# EAGLE design openSX70-dongle_v3-2 (EAGLE 8.6.3)
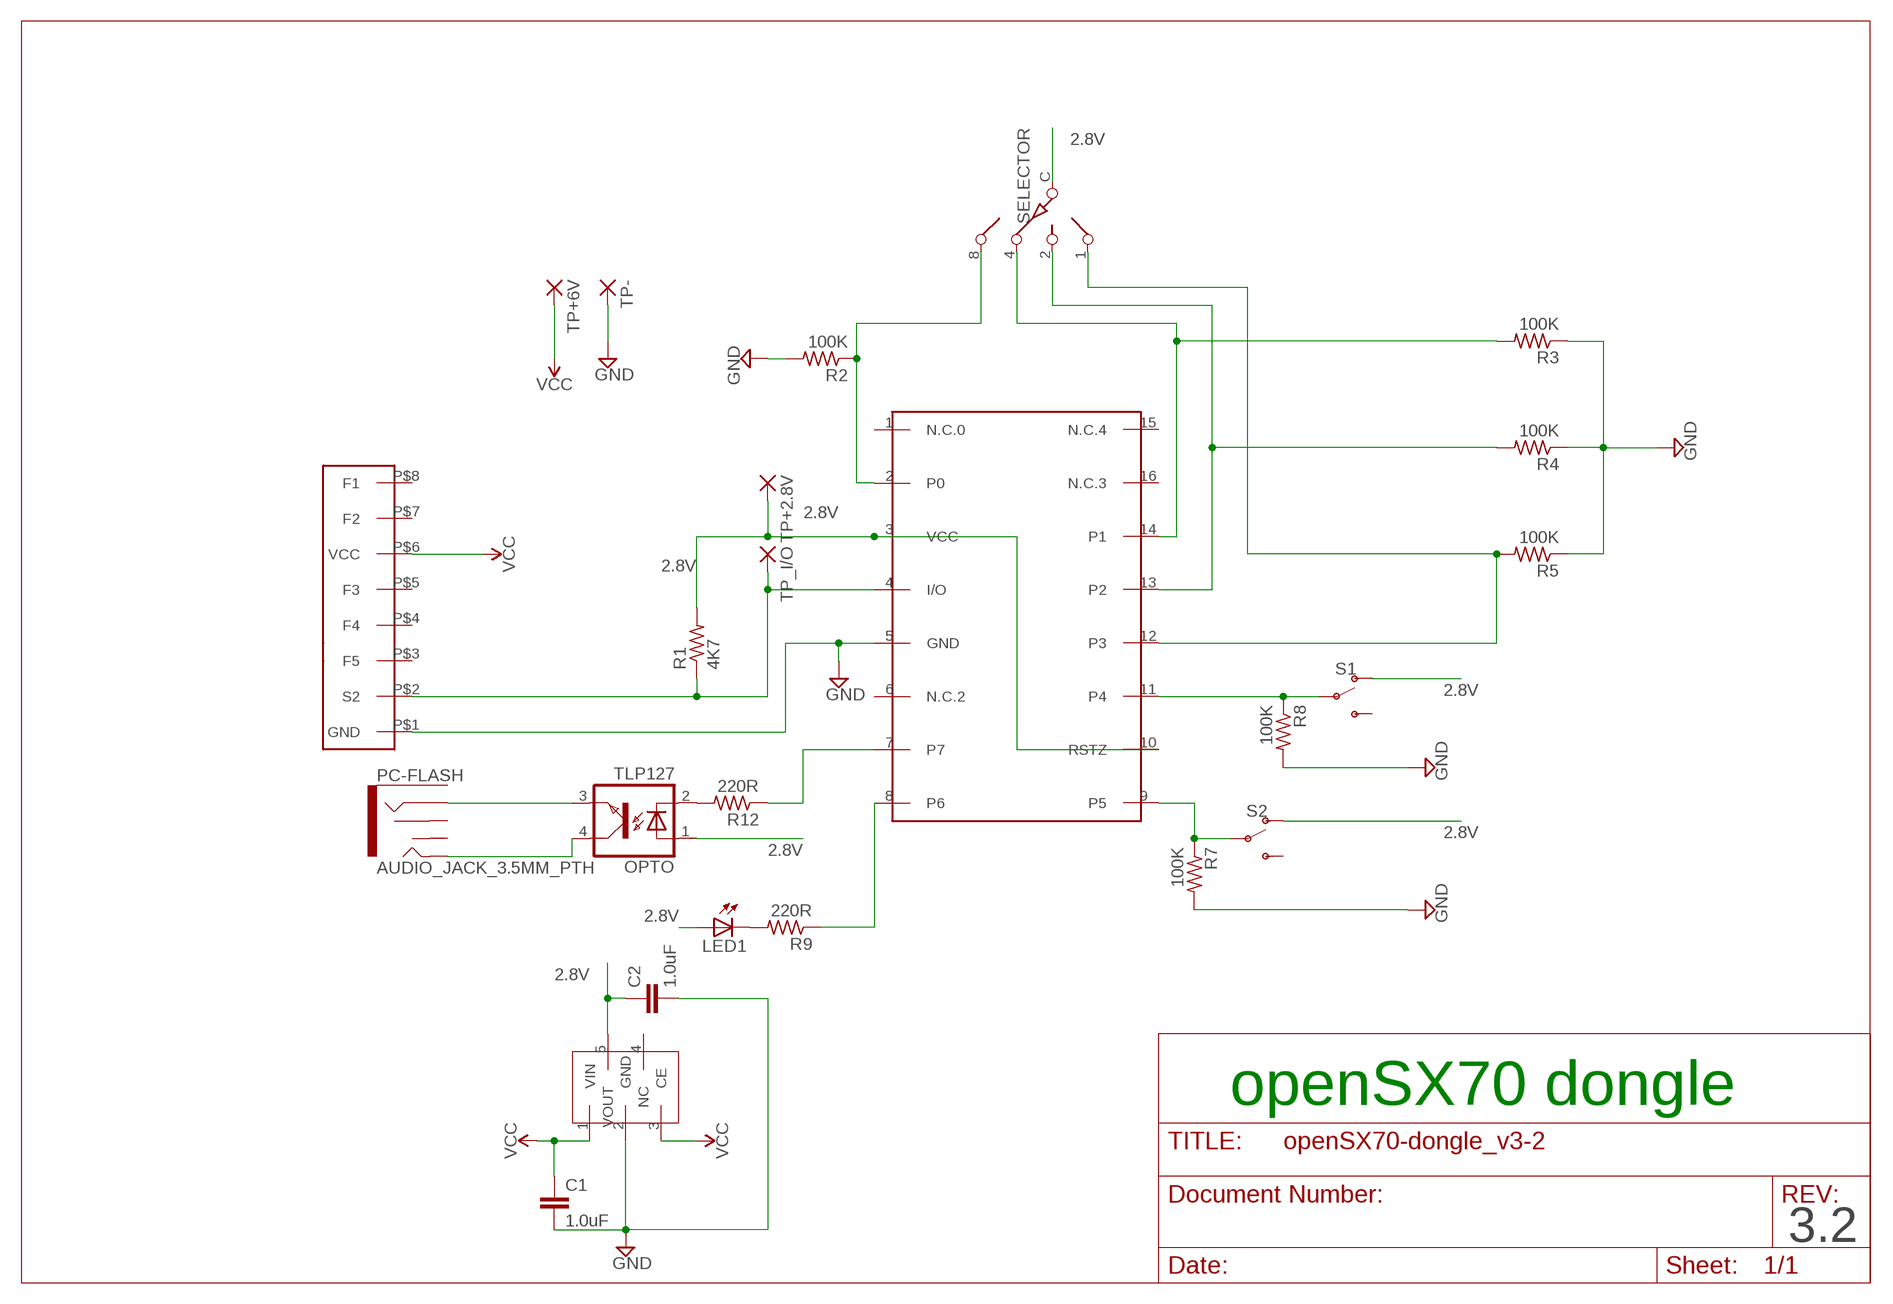
[diagram p0: schematic, sheet 1]

## Parts
C1  1.0uF  C-EUC0603  [C0603]
C2  1.0uF  C-EUC0603  [C0603]
DS2408  DS2408  [SO16]
LED1  LED3MM  [LED3MM]
OPTO  TLP127  [SO-4]
PC-FLASH  AUDIO_JACK_3.5MM_PTH  [AUDIO-JACK]
R1  4K7  R-US_M0805  [M0805]
R2  100K  R-US_M0805  [M0805]
R3  100K  R-US_M0805  [M0805]
R4  100K  R-US_M0805  [M0805]
R5  100K  R-US_M0805  [M0805]
R7  100K  R-US_M0805  [M0805]
R8  100K  R-US_M0805  [M0805]
R9  220R  R-US_M0805  [M0805]
R12  220R  R-US_M0805  [M0805]
REG  NCP4688  [SOT-23-5]
S1  SWITCH-SPDT-SMD-RIGHT-ANGLE  [SWITCH_SPST_SMD_A]
S2  SWITCH-SPDT-SMD-RIGHT-ANGLE  [SWITCH_SPST_SMD_A]
SELECTOR  SW-C16  [SW-C16]
TP+2.8V  SMD2  [SMD1,27-2,54]
TP+6V  SMD2  [SMD1,27-2,54]
TP-  SMD2  [SMD1,27-2,54]
TP_I/O  SMD2  [SMD1,27-2,54]
U$1  FLASH-EDGE-CONNECTOR  [FLASH-EDGE-8]

## Nets
2.8V: C2.1 DS2408.3(VCC) DS2408.10(RSTZ) LED1.A OPTO.1(A) R1.2 REG.5(VOUT) S1.1(O) S2.1(O) SELECTOR.C TP+2.8V.1(P)
GND: C1.2 C2.2 DS2408.5(GND) R2.2 R3.1 R4.1 R5.1 R7.2 R8.2 REG.2(GND) TP-.1(P) U$1.P$1(GND)
N$1: DS2408.4(I/O) R1.1 TP_I/O.1(P) U$1.P$2(S2)
N$2: LED1.K(C) R9.2
N$3: DS2408.2(P0) R2.1 SELECTOR.8
N$4: DS2408.14(P1) R3.2 SELECTOR.4
N$5: DS2408.13(P2) R4.2 SELECTOR.2
N$6: DS2408.11(P4) R8.1 S1.2(P)
N$7: DS2408.9(P5) R7.1 S2.2(P)
N$8: DS2408.8(P6) R9.1
N$10: OPTO.2(C) R12.2
N$11: DS2408.7 R12.1
N$12: OPTO.4(COL) PC-FLASH.TIP
N$13: DS2408.12(P3) R5.2 SELECTOR.1
N$15: OPTO.3(EMIT) PC-FLASH.RING
VCC: C1.1 REG.1(VIN) REG.3(CE) TP+6V.1(P) U$1.P$6(VCC)
Unconnected: DS2408.1(N.C.0) DS2408.6(N.C.2) DS2408.15(N.C.4) DS2408.16(N.C.3) PC-FLASH.RSH PC-FLASH.SLEEVE PC-FLASH.TSH REG.4(NC) S1.3(S) S2.3(S) U$1.P$3(F5) U$1.P$4(F4) U$1.P$5(F3) U$1.P$7(F2) U$1.P$8(F1)

## Notes on the sheet
- openSX70 dongle
- 3.2

## Library data of the parts
C1 C2 = rcl:C-EU: CAPACITOR, European symbol; SPICEPREFIX: C
DS2408 = DS2408-joaco:DS2408
LED1 = adafruit:LED: LED OSRAM: - CHIPLED LG R971, LG N971, LY N971, LG Q971, LY Q971, LO R971, LY R971 LH N974, LH R974 LS Q976, LO Q976, LY Q976 LO Q996 - Hyper CHIPLED LW Q18S LB Q993, LB Q99A, LB R99A - SideLED LS A670, LO A670, LY A670, LG A670, LP A670 LB A673, LV A673, LT A673, LW A673 LH A674 LY A675 LS A676, LA A676, LO A676, LY A676, LW A676 LS A679, LY A679, LG A679 - Hyper Micro SIDELED® LS Y876, LA Y876, LO Y876, LY Y876 LT Y87S - SmartLED LW L88C, LW L88S LB L89C, LB L89S, LG L890 LS L89K, LO L89K, LY L89K LS L896, LA L896, LO L896, LY L896 - TOPLED LS T670, LO T670, LY T670, LG T670, LP T670 LSG T670, LSP T670, LSY T670, LOP T670, LYG T670 LG T671, LOG T671, LSG T671 LB T673, LV T673, LT T673, LW T673 LH T674 LS T676, LA T676, LO T676, LY T676, LB T676, LH T676, LSB T676, LW T676 LB T67C, LV T67C, LT T67C, LS T67K, LO T67K, LY T67K, LW E67C LS E67B, LA E67B, LO E67B, LY E67B, LB E67C, LV E67C, LT E67C LW T67C LS T679, LY T679, LG T679 LS T770, LO T770, LY T770, LG T770, LP T770 LB T773, LV T773, LT T773, LW T773 LH T774 LS E675, LA E675, LY E675, LS T675 LS T776, LA T776, LO T776, LY T776, LB T776 LHGB T686 LT T68C, LB T68C - Hyper Mini TOPLED® LB M676 - Mini TOPLED Santana® LG M470 LS M47K, LO M47K, LY M47K Source: http://www.osram.convergy.de/
OPTO = openSX70:TLP127
PC-FLASH = SparkFun-Connectors:AUDIO_JACK_3.5MM: Audio Jack 3.5mm variants of PTH and SMT stereo audio jack with bypass switches. SparkFun Products: SparkFun SparkPunk Sound Kit <[https://www.sparkfun.com/products/11177]> - PTH MP3 Trigger <https://www.sparkfun.com/products/13720> -3.5mm SMD SparkFun PicoBoard <https://www.sparkfun.com/products/11888>- 2.5mm SMD; PROD_ID: CONN-08774; SF_ID: PRT-08032
R1-R5 R7-R9 R12 = rcl:R-US_: RESISTOR, American symbol; SPICEPREFIX: R
REG = openSX70:NCP4688
S1 S2 = SparkFun-Switches:SWITCH-SPDT: Single Pole, Double Throw (SPDT) Switch Single-pole, double-throw (SPDT) switch. Variant Overview SMD-AYZ0202 Surface Mount DPDT Switch <https://www.sparkfun.com/products/597> (COM-00597) Used on e.g. LilyPad Arduino USB - ATmega32U4 Board <https://www.sparkfun.com/products/12049> PTH-11.6X4.0MM SPDT Mini Power Switch <https://www.sparkfun.com/products/102> (COM-00102) Used on e.g. SparkFun Simon Says - Through-Hole Soldering Kit <https://www.sparkfun.com/products/10547> (KIT-10547) PTH-11.6X4.0MM-KIT KIT version of SPDT Mini Power Switch - Simplifies soldering by removing tStop of switch pins - only one side can be soldered. PTH-11.6X4.0MM-LOCK LOCK version of SPDT Mini Power Switch - Offset pins hold switch in place for easier soldering. SMD-RIGHT-ANGLE Surface Mount Right Angle Switch <https://www.sparkfun.com/products/10860> (COM-10860) Used on e.g. SparkFun ESP8266 Thing <https://www.sparkfun.com/products/13231>; PROD_ID: SWCH-10651; SF_SKU: COM-10860
SELECTOR = special:SW-C16: SWITCH 16-step rotary switch
TP+2.8V TP+6V TP- TP_I/O = wirepad:SMD2: SMD PAD
U$1 = SX70-flash:FLASH-EDGE-CONNECTOR

## Net classes
0 GND: width 0.305 mm
1 VCC: width 0.254 mm
2 2.8V: width 0.254 mm

## Board
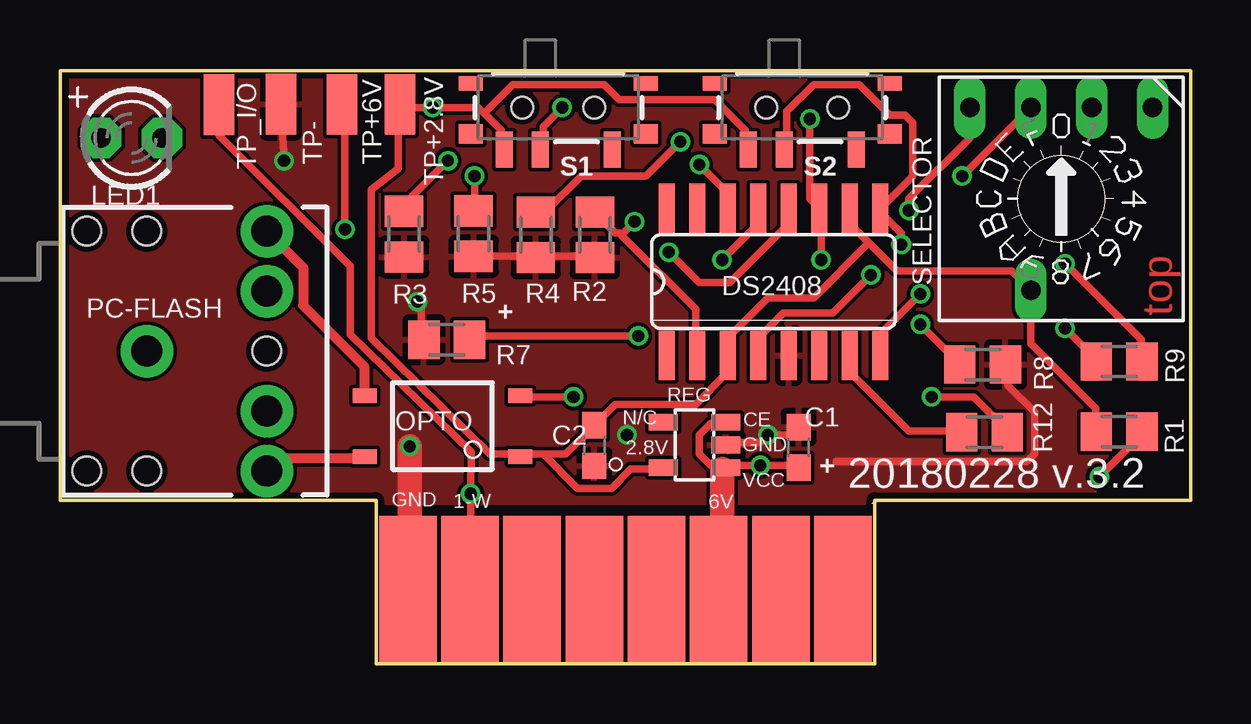
[diagram p1: board, top side]
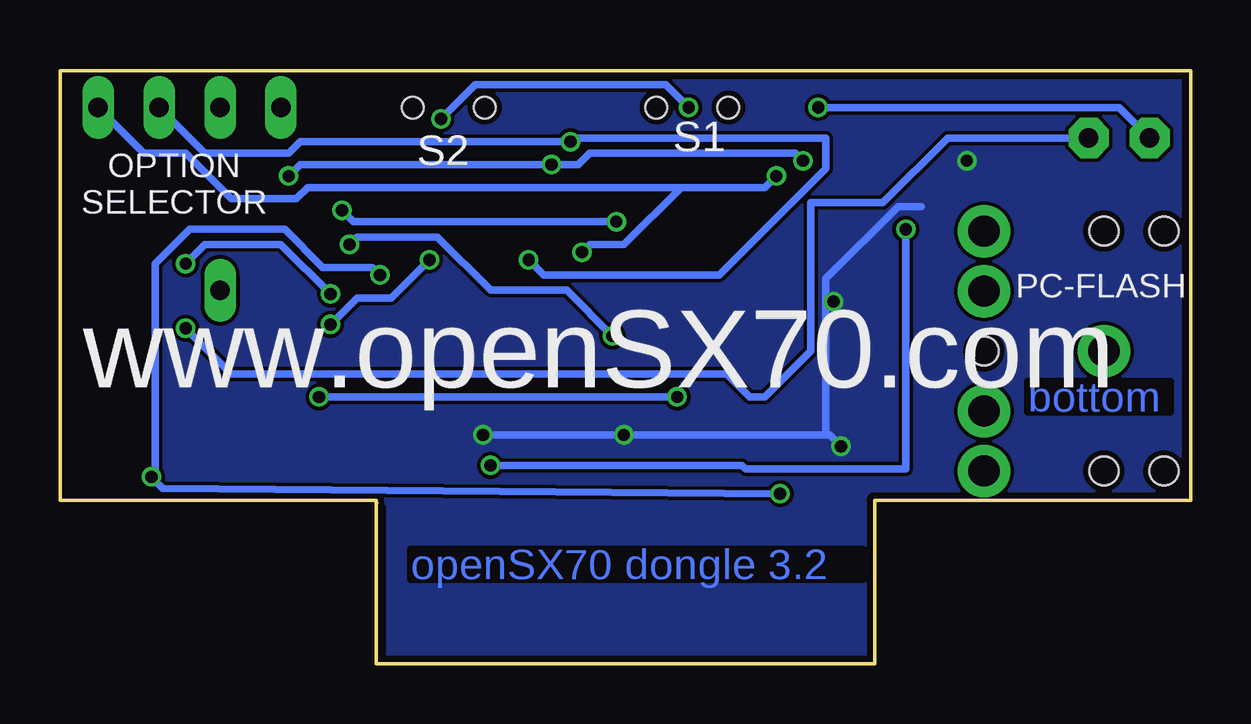
[diagram p2: board, bottom side, seen from below]

Size 47.12 x 24.71 mm. Coordinates in mm from the lower left corner, seen from the top.
Outline: 33.84,6.68 33.95,6.81
Outline: 33.95,6.81 33.95,0 13.17,0 13.17,6.81 0,6.81 0,24.71 47.12,24.71 47.12,6.81 33.95,6.81
Copper layers (1*16): Top 0.035mm / dielectric 1.5mm / Bottom 0.035mm
Design rules "SeeedStudio_2layer_DRU_no_angle_20140221": minimum track width 6mil, minimum drill 12mil, track to track 6mil, track to pad 6mil, pad to pad 6mil, via to via 6mil, smd to smd 0mil, copper to edge 10mil, drill to drill 10mil, minimum pad ring 10mil, minimum via ring 6mil, stop-mask expansion 2mil, vias tented up to drill 100mil, thermal gap 10mil

### Footprints (pad centres in the part's own frame; a part is rotated, then mirrored left to right if it is on the bottom)
C0603 = smd 1.1 x 1: 1 -0.85,0; 2 0.85,0
SO16 = smd 0.66 x 2.032: 1 -4.445,-3.073; 2 -3.175,-3.073; 3 -1.905,-3.073; 4 -0.635,-3.073; 5 0.635,-3.073; 6 1.905,-3.073; 7 3.175,-3.073; 8 4.445,-3.073; 9 4.445,3.073; 10 3.175,3.073; 11 1.905,3.073; 12 0.635,3.073; 13 -0.635,3.073; 14 -1.905,3.073; 15 -3.175,3.073; 16 -4.445,3.073
LED3MM = drill 0.813 pad 1.676 octagon: A -1.27,0; K 1.27,0
SO-4 = smd 1 x 0.6: 1 -3.24,0.635; 2 -3.24,-1.905; 3 3.24,-1.905; 4 3.24,0.635
AUDIO-JACK = drill 1.3 pad 2.184: RING 5,5; RSH 5,2.5; SLEEVE 0,0; TIP 5,-5; TSH 5,-2.5 | hole 1.2: 0,5; -2.5,5; -2.5,-5; 0,-5; 5,0
M0805 = smd 1.3 x 1.6: 1 -0.95,0; 2 0.95,0
SOT-23-5 = smd 0.69 x 1.2: 1 -0.95,-1.3; 2 0,-1.3; 3 0.95,-1.3; 4 0.95,1.3; 5 -0.95,1.3
SWITCH_SPST_SMD_A = smd 0.7 x 1.5: 1 -2.25,-1.75; 2 -0.75,-1.75; 3 2.25,-1.75 | smd 1 x 0.6: GND1 -3.65,1; GND3 3.65,1 | smd 1 x 0.8: GND2 -3.65,-1.1; GND4 3.65,-1.1 | hole 0.9: -1.5,0; 1.5,0
SW-C16 = drill 0.813 long: 1 -3.81,-3.81; 2 -1.27,-3.81; 4 1.27,-3.81; 8 3.81,-3.81; C 1.27,3.81
SMD1,27-2,54 = smd 1.27 x 2.54: 1 0,0
FLASH-EDGE-8 = smd 2.4 x 6.09: P$1 -9.065,0; P$2 -6.475,0; P$3 -3.885,0; P$4 -1.295,0; P$5 1.295,0; P$6 3.885,0; P$7 6.475,0; P$8 9.065,0

### Placement (x,y rotation side)
C1  30.77,9.02 90 top
C2  22.26,9.09 270 top
DS2408  29.73,15.93 0 top
LED1  2.98,21.92 0 top
OPTO  15.93,9.27 180 top
PC-FLASH  3.62,13.03 0 top
R1  44.13,9.68 180 top
R2  22.29,17.88 270 top
R3  14.34,17.91 90 top
R4  19.82,17.88 90 top
R5  17.23,17.93 90 top
R7  16.12,13.51 180 top
R8  38.44,12.47 0 top
R9  44.13,12.6 180 top
R12  38.52,9.65 0 top
REG  26.44,9.12 90 top
S1  20.76,23.19 0 top
S2  30.92,23.19 0 top
SELECTOR  41.72,19.38 180 top
TP+2.8V  14.16,23.32 0 top
TP+6V  11.75,23.32 0 top
TP-  9.21,23.33 0 top
TP_I/O  6.63,23.3 0 top
U$1  23.56,3.12 0 top

### Tracks (layer width: path | path; a pad name or v marks a point on that pad's centre or on a via)
2.8V  (via drill 0.51)
  Top 0.305: 17.67,22.95 17.43,23.19 v15.53,23.19 14.26,23.19 TP+2.8V.1 14.1,23.19 14.1,20.65 12.97,19.77 12.97,13.58 17.91,8.74 19.02,8.74 OPTO.1 19.18,8.74 20.13,8.74 | 17.67,22.95 18.38,22.24 18.38,21.44 S1.1 | 17.67,22.95 18.86,24.14 22.67,24.14 23.3,23.51 27.27,23.51 28.54,22.24 28.54,21.44 S2.1 | 20.13,8.74 21.08,8.74 22.19,9.86 C2.1 22.35,10.01 23.15,10.81 26.48,10.81 27.75,12.08 27.75,12.71 DS2408.3 27.91,12.87 27.91,13.67 29.5,15.25 31.4,15.25 33.7,17.55 | 20.13,8.74 21.56,7.32 22.99,7.32 23.78,8.11 25.05,8.11 REG.5 | R1.2 43.15,9.7 43.15,10.65 40.45,13.35 SELECTOR.C 39.66,16.36 34.89,16.36 33.7,17.55 | 33.7,17.55 32.99,18.27 32.99,18.9 DS2408.10
  Bottom 0.305: LED1.A 2.98,23.19 v15.53,23.19
GND  (via drill 0.51)
  Top 0.305: R7.2 15.05,13.67 15.05,15.09 v14.89,15.09 | 14.41,16.84 R3.1 | R5.1 17.27,17 19.81,17 R4.1 19.97,17 22.19,17 R2.2 | 22.35,8.27 C2.2 | C1.2 30.77,9.86 30.45,9.54 v29.5,9.54 29.18,9.22 27.75,9.22 REG.2 | 32.35,8.43 40.29,8.43 40.61,8.74 40.61,10.49 39.5,11.6 39.5,12.4 R8.2 | 30.92,9.86 C1.2 | 30.45,12.71 DS2408.5 | 30.45,9.7 C1.2 | v9.33,20.97 TP-.1 | 14.57,3.19 U$1.P$1
  Top 1.016: v14.57,9.06 14.57,3.19
  Bottom 0.305: v29.5,9.54 v23.62,9.54 15.21,9.54 | 11.24,19.06 12.19,19.06 15.21,16.05 15.21,15.09 | 15.21,9.54 15.21,15.09 | 15.21,15.09 v14.89,15.09 | v14.57,9.06 15.05,9.54 15.21,9.54
  pour Top: 0.44,24.46 47.43,24.46 47.43,6.68 0.44,6.68
  pour Bottom: 0.44,24.46 0.44,6.68 13.14,6.68 13.14,0.33 33.46,0.33 33.46,6.68 47.43,6.68 47.43,24.46
N$1  (via drill 0.51)
  Top 0.305: v43.31,7.79 45.05,9.54 R1.1 | U$1.P$2 17.11,3.19 v17.11,7.09 17.13,8.83 12.1,13.73 12.1,16.59 6.63,22.01 TP_I/O.1 6.63,23.76 | v33.78,16.21 32.19,14.62 30.13,14.62 29.18,13.67 29.18,12.87 DS2408.4
  Bottom 0.305: v17.11,7.09 42.83,7.32 v43.31,7.79 43.15,7.79 43.15,16.68 41.72,18.11 37.75,18.11 36.16,16.52 34.1,16.52 v33.78,16.21
N$2  (via drill 0.51)
  Top 0.305: v41.88,13.98 43.15,12.71 R9.2
  Bottom 0.305: v41.88,13.98 39.97,12.08 19.34,12.08 18.38,11.13 17.75,11.13 15.84,13.03 15.84,19.22 12.83,19.22 10.13,21.92 LED1.K
N$3  (via drill 0.51)
  Top 0.305: 23.38,17.87 26.48,14.78 26.48,12.87 DS2408.2 | 23.38,17.87 23.3,17.95 23.15,17.95 22.35,18.75 R2.1 | SELECTOR.8 37.91,21.92 35.37,19.38 v35.37,18.9 | 23.38,17.87 v23.94,18.43
  Bottom 0.305: v35.37,18.9 34.89,18.43 v23.94,18.43
N$4  (via drill 0.51)
  Top 0.305: v16.16,20.97 14.41,19.22 14.41,18.9 R3.2 | v26.64,20.81 27.75,19.7 27.75,19.06 DS2408.14 | v37.59,20.33 SELECTOR.4
  Bottom 0.305: v16.16,20.97 16.48,21.29 25.05,21.29 25.53,20.81 v26.64,20.81 37.12,20.81 v37.59,20.33
N$5  (via drill 0.51)
  Top 0.305: v25.84,21.76 24.42,20.33 21.72,20.33 20.29,18.9 19.97,18.9 R4.2 | v27.59,16.84 29.02,18.27 29.02,18.9 DS2408.13
  Bottom 0.305: SELECTOR.2 41.08,21.29 37.59,21.29 37.12,21.76 v25.84,21.76 25.69,21.92 15.21,21.92 15.21,20.65 19.65,16.21 26.96,16.21 v27.59,16.84
N$6  (via drill 0.51)
  Top 0.305: v20.92,23.19 20.13,22.4 20.13,21.44 S1.2 | v31.24,22.71 31.24,19.38 31.56,19.06 DS2408.11 31.72,18.9 v31.72,16.84 | v35.85,14.14 37.43,12.55 R8.1
  Bottom 0.305: v20.92,23.19 21.88,24.14 29.81,24.14 v31.24,22.71 | v35.85,14.14 34.73,15.25 33.31,15.25 v31.72,16.84
N$7  (via drill 0.51)
  Top 0.305: S2.2 30.29,21.44 30.29,23.03 31.4,24.14 33.31,24.14 34.58,22.87 35.21,22.87 35.53,22.56 35.53,20.33 34.26,19.06 DS2408.9 34.1,18.9 35.05,17.95 v35.05,17.48 | v24.1,13.67 17.11,13.67 R7.1
  Bottom 0.305: v24.1,13.67 26,15.57 29.18,15.57 31.4,17.79 34.73,17.79 v35.05,17.48
N$8  (via drill 0.51)
  Top 0.305: v41.88,16.68 45.05,13.51 45.05,12.71 R9.1 | v35.85,15.41 34.26,13.82 34.26,12.87 DS2408.8
  Bottom 0.305: v41.88,16.68 41.08,17.48 37.91,17.48 v35.85,15.41
N$10  (via drill 0.51)
  Top 0.305: v21.4,11.13 19.18,11.13 OPTO.2 | v36.32,11.13 38.07,11.13 39.5,9.7 R12.2
  Bottom 0.305: v36.32,11.13 v21.4,11.13
N$11
  Top 0.305: R12.1 37.43,9.7 35.37,9.7 32.99,12.08 32.99,12.71 DS2408.7
N$12
  Top 0.305: 12.67,8.59 OPTO.4 | 8.7,8.11 PC-FLASH.TIP
  Top 0.406: 12.67,8.59 9.18,8.59 8.7,8.11
N$13  (via drill 0.51)
  Top 0.305: v17.27,20.33 17.27,18.9 R5.2 | v25.37,17.16 26.64,15.89 27.91,15.89 30.29,18.27 30.29,18.9 DS2408.12
  Bottom 0.305: v17.27,20.33 17.75,19.86 21.24,19.86 | 21.24,19.86 36.8,19.86 37.27,19.38 39.97,19.38 41.88,21.29 43.62,21.29 SELECTOR.1 | v25.37,17.16 25.05,17.48 23.62,17.48 21.24,19.86
N$15
  Top 0.305: 12.67,11.28 OPTO.3 | 8.7,17.95 PC-FLASH.RING
  Top 0.406: 12.67,11.28 12.67,12.4 10.13,14.94 10.13,16.52 8.7,17.95
VCC  (via drill 0.51)
  Top 0.305: C1.1 30.77,8.27 v29.18,8.27 27.75,8.27 REG.1 | REG.3 27.59,10.01 27.11,10.01 26.64,9.54 26.64,8.74 27.11,8.27 27.59,8.27 REG.1 | v11.87,18.11 11.87,23.19 TP+6V.1 | 27.59,3.19 U$1.P$6 | 27.59,8.11 REG.1
  Top 1.016: 27.59,8.11 27.59,3.19
  Bottom 0.305: v11.87,18.11 11.87,8.11 18.54,8.11 18.7,8.27 v29.18,8.27

### Text on the board
Top: top
Bottom: bottom | openSX70 dongle 3.2
tPlace: + | + | 20180228 v.3.2
bPlace: www.openSX70.com
tNames: N/C | CE | 2.8V | GND | VCC | GND | 1-W | 6V
bNames: S1 | S2 | OPTION / SELECTOR | PC-FLASH